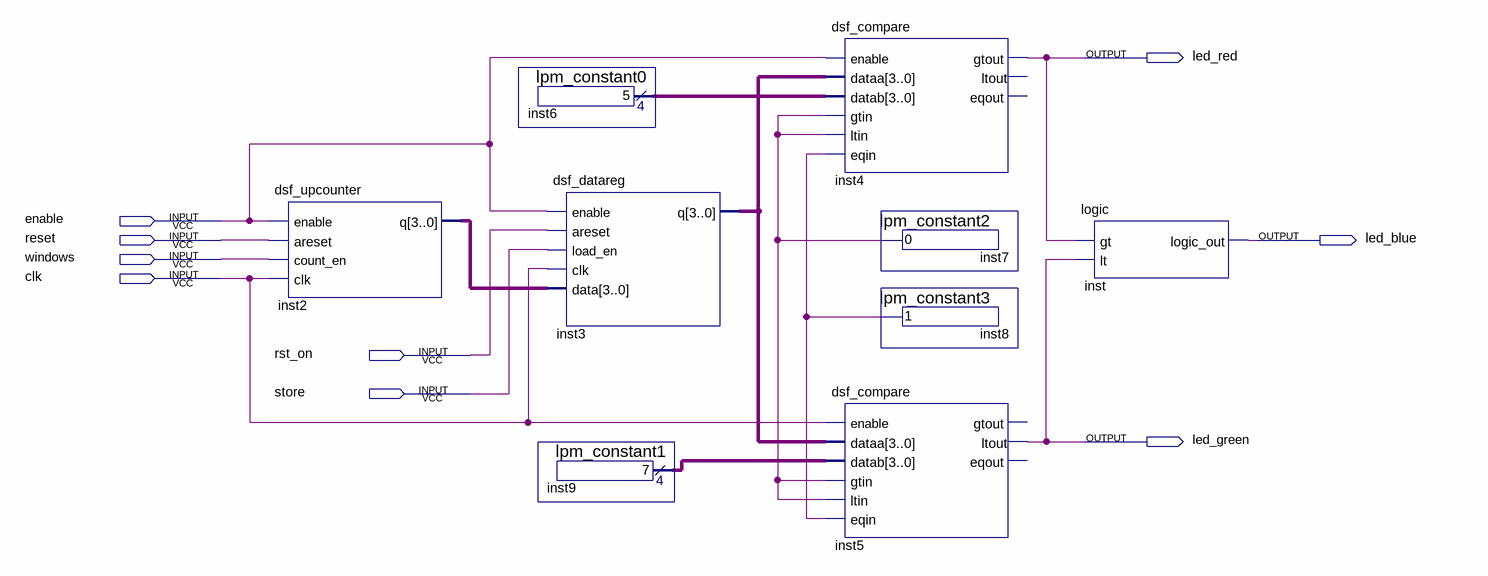
[diagram p0: schematic sheet]
// Quartus schematic esquematico.bdf as structural Verilog: 9 symbols, 9 pins
module esquematico (
  input  enable,
  input  reset,
  input  windows,
  input  clk,
  input  rst_on,
  input  store,
  output led_red,
  output led_blue,
  output led_green
);

  wire inst7_result, inst8_result;
  wire [3:0] inst2_q, inst3_q, inst6_result, inst9_result;

  dsf_upcounter inst2 (.enable(enable), .areset(reset), .count_en(windows), .clk(clk), .q(inst2_q));
  lpm_constant0 inst6 (.result(inst6_result));
  dsf_datareg inst3 (.enable(enable), .areset(rst_on), .load_en(store), .clk(clk), .data(inst2_q), .q(inst3_q));
  lpm_constant1 inst9 (.result(inst9_result));
  dsf_compare inst4 (
    .enable(enable), .dataa(inst3_q), .datab(inst6_result), .gtin(inst7_result), .ltin(inst7_result),
    .eqin(inst8_result), .gtout(led_red));  // open: ltout, eqout
  dsf_compare inst5 (
    .enable(clk), .dataa(inst3_q), .datab(inst9_result), .gtin(inst7_result), .ltin(inst7_result),
    .eqin(inst8_result), .ltout(led_green));  // open: gtout, eqout
  lpm_constant2 inst7 (.result(inst7_result));
  lpm_constant3 inst8 (.result(inst8_result));
  \logic  inst (.gt(led_red), .lt(led_green), .logic_out(led_blue));
endmodule
